# EAGLE schematic arduino_Uno_Rev3-02-TH (EAGLE 7.7.0)
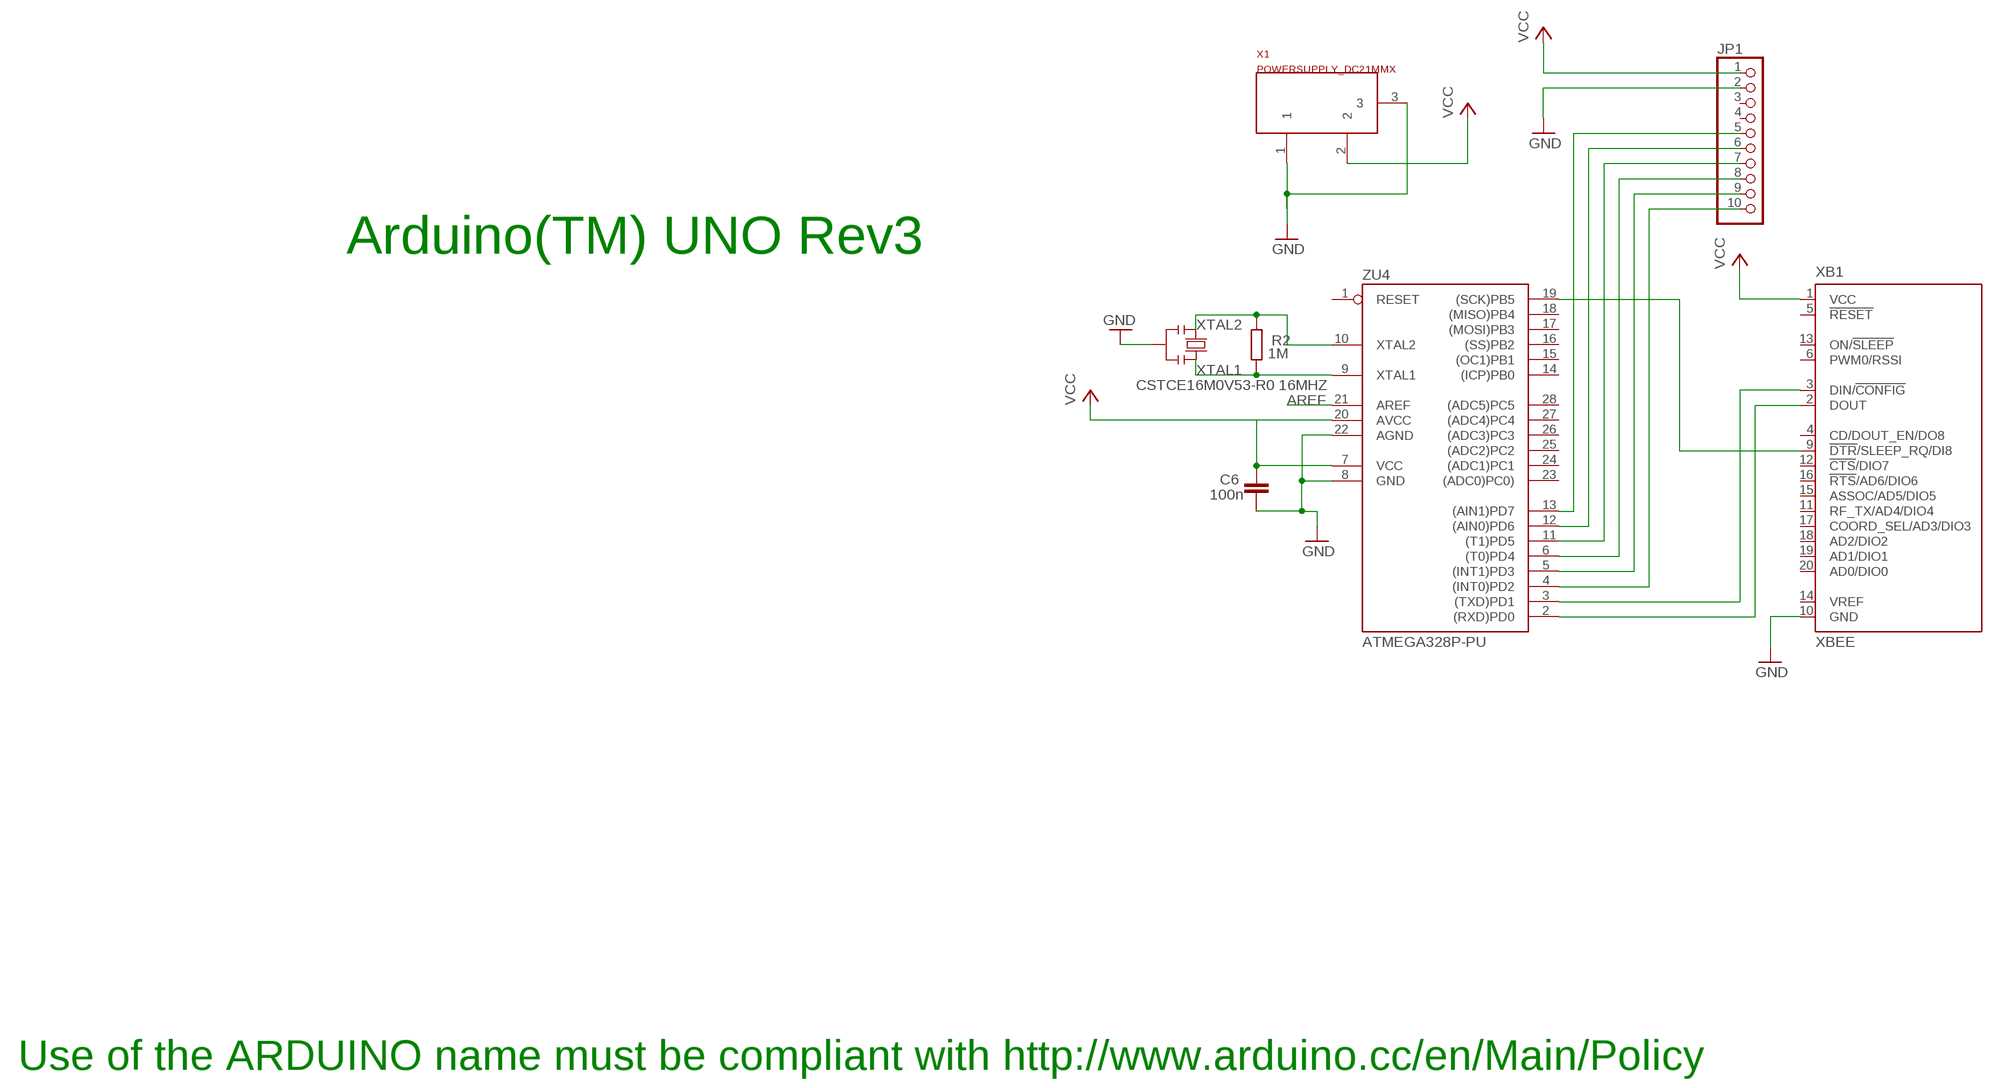
[diagram p0: schematic, sheet 1]

## Parts
C6  100n  C-EU0603-RND  [C0603-ROUND]
JP1  PINHD-1X10  [1X10]
R2  1M  R-EU_R0603  [R0603-ROUND]
X1  POWERSUPPLY_DC21MMX  [POWERSUPPLY_DC-21MM]
XB1  XBEE  [XBEE]
Y2  CSTCE16M0V53-R0 16MHZ  RESONATORMU  [RESONATOR]
ZU4  ATMEGA328P-PU  [DIL28-3]

## Nets
AREF [aref]: ZU4.21(AREF)
GND [gnd]: C6.1 JP1.2 X1.1 X1.3 XB1.10(GND) Y2.2 ZU4.8(GND) ZU4.22(AGND)
N$1: XB1.3(DIN/!CONFIG) ZU4.3((TXD)PD1)
N$2: JP1.10 ZU4.4((INT0)PD2)
N$3: XB1.2(DOUT) ZU4.2((RXD)PD0)
N$4: JP1.5 ZU4.13((AIN1)PD7)
N$5: JP1.8 ZU4.6((T0)PD4)
N$6: JP1.7 ZU4.11((T1)PD5)
N$7: JP1.6 ZU4.12((AIN0)PD6)
N$8: JP1.9 ZU4.5((INT1)PD3)
N$9: XB1.9(!DTR!/SLEEP_RQ/DI8) ZU4.19((SCK)PB5)
VCC: C6.2 JP1.1 X1.2 XB1.1(VCC) ZU4.7(VCC) ZU4.20(AVCC)
XTAL1: R2.1 Y2.3 ZU4.9(XTAL1)
XTAL2: R2.2 Y2.1 ZU4.10(XTAL2)
Unconnected: JP1.3 JP1.4 XB1.4(CD/DOUT_EN/DO8) XB1.5(!RESET) XB1.6(PWM0/RSSI) XB1.11(RF_TX/AD4/DIO4) XB1.12(!CTS!/DIO7) XB1.13(ON/!SLEEP) XB1.14(VREF) XB1.15(ASSOC/AD5/DIO5) XB1.16(!RTS!/AD6/DIO6) XB1.17(COORD_SEL/AD3/DIO3) XB1.18(AD2/DIO2) XB1.19(AD1/DIO1) XB1.20(AD0/DIO0) ZU4.1(RESET) ZU4.14((ICP)PB0) ZU4.15((OC1)PB1) ZU4.16((SS)PB2) ZU4.17((MOSI)PB3) ZU4.18((MISO)PB4) ZU4.23((ADC0)PC0)) ZU4.24((ADC1)PC1) ZU4.25((ADC2)PC2) ZU4.26((ADC3)PC3) ZU4.27((ADC4)PC4) ZU4.28((ADC5)PC5)

## Notes on the sheet
- Arduino(TM) UNO Rev3
- Use of the ARDUINO name must be compliant with http://www.arduino.cc/en/Main/Policy

## Library data of the parts
C6 = SmartPrj:C-EU: CAPACITOR, European symbol
JP1 = pinhead:PINHD-1X10: PIN HEADER
R2 = SmartPrj:R-EU_: RESISTOR, European symbol
X1 = SmartPrj:POWERSUPPLY_DC21MM
XB1 = maxstream:XBEE: XBee (TM) /XBee-PRO(TM) OEM RF Modules Source: MaxStream, Inc. xbee_productmanual.pdf; MPN: XBP24-Z7UIT-004; OC_FARNELL: 1751799; OC_NEWARK: 34R5507
Y2 = SmartPrj:RESONATOR
ZU4 = SmartPrj:ATMEGA328P-: MICROCONTROLLER 4 Kbytes FLASH 128 bytes SRAM 256 bytes EEPROM UART 6-channel 10 bit ADC

## Net classes
0 default: width 0.254 mm, clearance 0.254 mm
1 power: width 0.61 mm, drill 0.61 mm, clearance 0.254 mm
2 gnd: width 0.305 mm, drill 0.559 mm, clearance 0.254 mm
3 usbvcc: width 0.508 mm, drill 0.61 mm, clearance 0.254 mm
4 aref: width 0.406 mm, drill 0.61 mm, clearance 0.254 mm